# Altium schematic sheet LTE_MCU_Rev0.01.SchDoc
size Letter; SheetNumber: 6; SheetTotal: 6
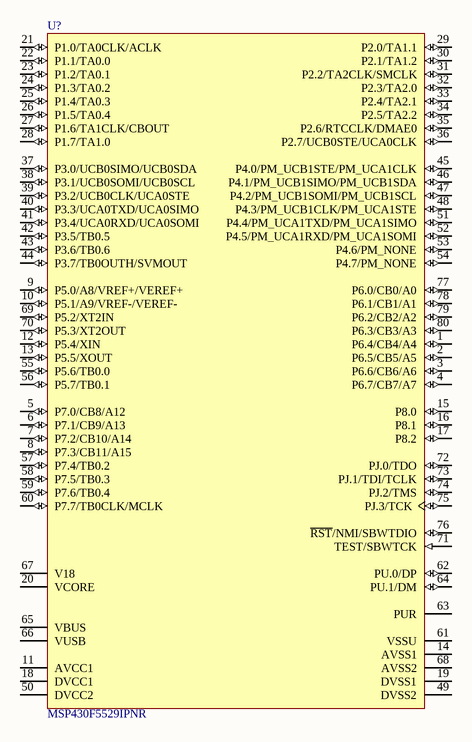
[diagram p0: LTE_MCU_Rev0.01.SchDoc]

## Parts
U?  MSP430F5529IPNR  [PN0080A_L]

## Nets

Not connected (* = marked no-connect by the designer): U? 1(P6.4/CB4/A4) 2(P6.5/CB5/A5) 3(P6.6/CB6/A6) 4(P6.7/CB7/A7) 5(P7.0/CB8/A12) 6(P7.1/CB9/A13) 7(P7.2/CB10/A14) 8(P7.3/CB11/A15) 9(P5.0/A8/VREF+/VEREF+) 10(P5.1/A9/VREF-/VEREF-) 11(AVCC1) 12(P5.4/XIN) 13(P5.5/XOUT) 14(AVSS1) 15(P8.0) 16(P8.1) 17(P8.2) 18(DVCC1) 19(DVSS1) 20(VCORE) 21(P1.0/TA0CLK/ACLK) 22(P1.1/TA0.0) 23(P1.2/TA0.1) 24(P1.3/TA0.2) 25(P1.4/TA0.3) 26(P1.5/TA0.4) 27(P1.6/TA1CLK/CBOUT) 28(P1.7/TA1.0) 29(P2.0/TA1.1) 30(P2.1/TA1.2) 31(P2.2/TA2CLK/SMCLK) 32(P2.3/TA2.0) 33(P2.4/TA2.1) 34(P2.5/TA2.2) 35(P2.6/RTCCLK/DMAE0) 36(P2.7/UCB0STE/UCA0CLK) 37(P3.0/UCB0SIMO/UCB0SDA) 38(P3.1/UCB0SOMI/UCB0SCL) 39(P3.2/UCB0CLK/UCA0STE) 40(P3.3/UCA0TXD/UCA0SIMO) 41(P3.4/UCA0RXD/UCA0SOMI) 42(P3.5/TB0.5) 43(P3.6/TB0.6) 44(P3.7/TB0OUTH/SVMOUT) 45(P4.0/PM_UCB1STE/PM_UCA1CLK) 46(P4.1/PM_UCB1SIMO/PM_UCB1SDA) 47(P4.2/PM_UCB1SOMI/PM_UCB1SCL) 48(P4.3/PM_UCB1CLK/PM_UCA1STE) 49(DVSS2) 50(DVCC2) 51(P4.4/PM_UCA1TXD/PM_UCA1SIMO) 52(P4.5/PM_UCA1RXD/PM_UCA1SOMI) 53(P4.6/PM_NONE) 54(P4.7/PM_NONE) 55(P5.6/TB0.0) 56(P5.7/TB0.1) 57(P7.4/TB0.2) 58(P7.5/TB0.3) 59(P7.6/TB0.4) 60(P7.7/TB0CLK/MCLK) 61(VSSU) 62(PU.0/DP) 63(PUR) 64(PU.1/DM) 65(VBUS) 66(VUSB) 67(V18) 68(AVSS2) 69(P5.2/XT2IN) 70(P5.3/XT2OUT) 71(TEST/SBWTCK) 72(PJ.0/TDO) 73(PJ.1/TDI/TCLK) 74(PJ.2/TMS) 75(PJ.3/TCK) 76(~{RST}/NMI/SBWTDIO) 77(P6.0/CB0/A0) 78(P6.1/CB1/A1) 79(P6.2/CB2/A2) 80(P6.3/CB3/A3)

## Library data of the parts
U? = CMP-0365-00413-2: 25 MHz Mixed Signal Microcontroller with 128 KB Flash, 8192 B SRAM and 63 GPIOs, -40 to 85 degC, 80-pin QFP (PN), Green (RoHS & no Sb/Br); Manufacturer: Texas Instruments; Flash(KB): 128; ADC Channels: 16; Temp Sensor: Yes; SubFamily: 5 Series; Frequency(MHz): 25; Multiplier: 32x32; DMA: 3; USB: 1; SRAM(B): 8192; GPIO: 63; USCI_A (UART/LIN/IrDA/SPI): 2; ADC: 12-bit SAR; Timers - 16-bit: 4; ComponentLink1URL: http://www.ti.com/; ComponentLink2URL: http://www.ti.com/general/docs/lit/getliterature.tsp?genericPartNumber=MSP430F5529&fileType=pdf; DatasheetVersion: SLAS590I; ComponentLink2Description: Datasheet; ComponentLink3URL: http://www.ti.com/lit/ml/mtqf010a/mtqf010a.pdf; Watchdog: Yes; Brown Out Reset: Yes; PartNumber: MSP430F5529IPNR; Comparators: Yes; Code_JEDEC: MS-018; PackageReference: PN0080A; ComponentLink1Description: Manufacturer URL; Eco-Plan: Green (RoHS & no Sb/Br); SVS: Yes; USCI_B (I2C & SPI): 2; Mounting Technology: Surface Mount; Real-Time Clock: Yes; ComponentLink3Description: Package Specification; PackageDescription: 80-Pin Plastic Quad Flat Pack, Body 12 x 12 mm, Pitch 0.5 mm